# Altium project PCB Motor BD67173NUX .PrjPcb
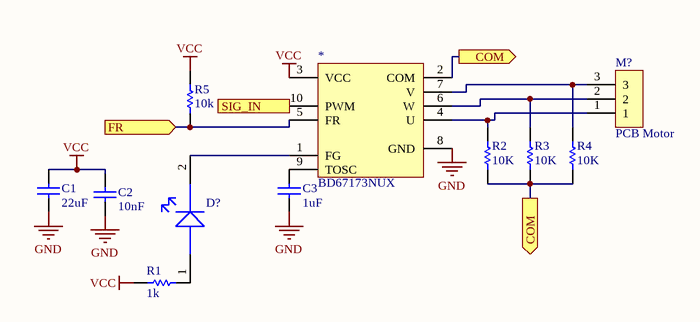
[diagram p0: Sheet1.SchDoc]
1 sheet, 11 parts. Net scope: flat (ports and power ports of the same name join across sheets).
Board file: PCB1.PcbDoc

## Sheet Sheet1.SchDoc
size A4; SheetNumber: 1; SheetTotal: 1

### Parts
*  BD67173NUX  [BD67173NUX - duplicate]
C1  22uF  [CAPC1005X56X25ML10T15]
C2  10nF  [CAPC1005X56X25ML10T15]
C3  1uF  [CAPC1005X56X25ML10T15]
D?  'LTST-C190KFKT  [RESC1608X04N]  (value not drawn)
M?  PCB Motor  [PCB Motor 6Sv5]
R1  1k  [RESC1005X40X25ML5T10]
R2  10K  [RESC1005X40X25ML5T10]
R3  10K  [RESC1005X40X25ML5T10]
R4  10K  [RESC1005X40X25ML5T10]
R5  10k  [RESC1005X40X25ML5T10]

### Ports
COM (out), FR (in), SIG_IN (in)

### Nets
GND: *.8(GND) C1.1 C2.1 C3.1
VCC: *.3(VCC) C1.2 C2.2 R1.1 R5.1
Net*_1: *.1(FG) D?.2
Net*_2: *.2(COM) R2.2 R3.2 R4.2 ; port COM
Net*_4: *.4(U) M?.1 R2.1
Net*_5: *.5(FR) R5.2 ; port FR
Net*_6: *.6(W) M?.2 R3.1
Net*_7: *.7(V) M?.3 R4.1
Net*_9: *.9(TOSC) C3.2
Net*_10: *.10(PWM) ; port SIG_IN
NetD?_1: D?.1 R1.2

### Library data of the parts
C1 C3 = CMP-2008-02800-1: 'LMK105BJ225MV-F; Manufacturer: AVX Interconnect / Elco; Part Number: 0402YC104KAT2A
C2 = CMP-2008-02799-1: '04025C103MAT2A; Manufacturer: AVX Interconnect / Elco; Part Number: 0402YC103MAT2A
D? = LED
R1-R5 = CMP-2002-07915-2: 'RC0402JR-0710KL; Resistance: 10 kohm; Voltage Rating (DC): 50 V; Power Rating: 63 mW; Tolerance: 5%; Case\Package: 0402; RoHSCompliant: true; DatasheetVersion: Rev. 4, 02/2016; ComponentLink1Description: Manufacturer URL; PackageDescription: 2-Pin Surface Mount Device, Body 1 x 0.5 mm; Case Code (Imperial): 0402; PackageReference: 0402; ComponentLink1URL: http://www.yageo.com/; Mounting Technology: Surface Mount; REACH SVHC: No SVHC; ComponentLink2Description: Datasheet; Case Code (Metric): 1005; Width: 0.5 mm; Package Quantity: 10000; Packaging: Tape and Reel; Max Operating Temperature: 155 degC; Mount: Surface Mount; Length: 1 mm; ComponentLink2URL: http://www.yageo.com/documents/recent/PYu-RC_Group_51_RoHS_L_04.pdf; Height: 0.35 mm; Voltage Rating: 50 V; Pins: 2; Min Operating Temperature: -55 degC